# EAGLE design femtoBeacon_dongle_r2.0.1 (EAGLE 7.5.0)
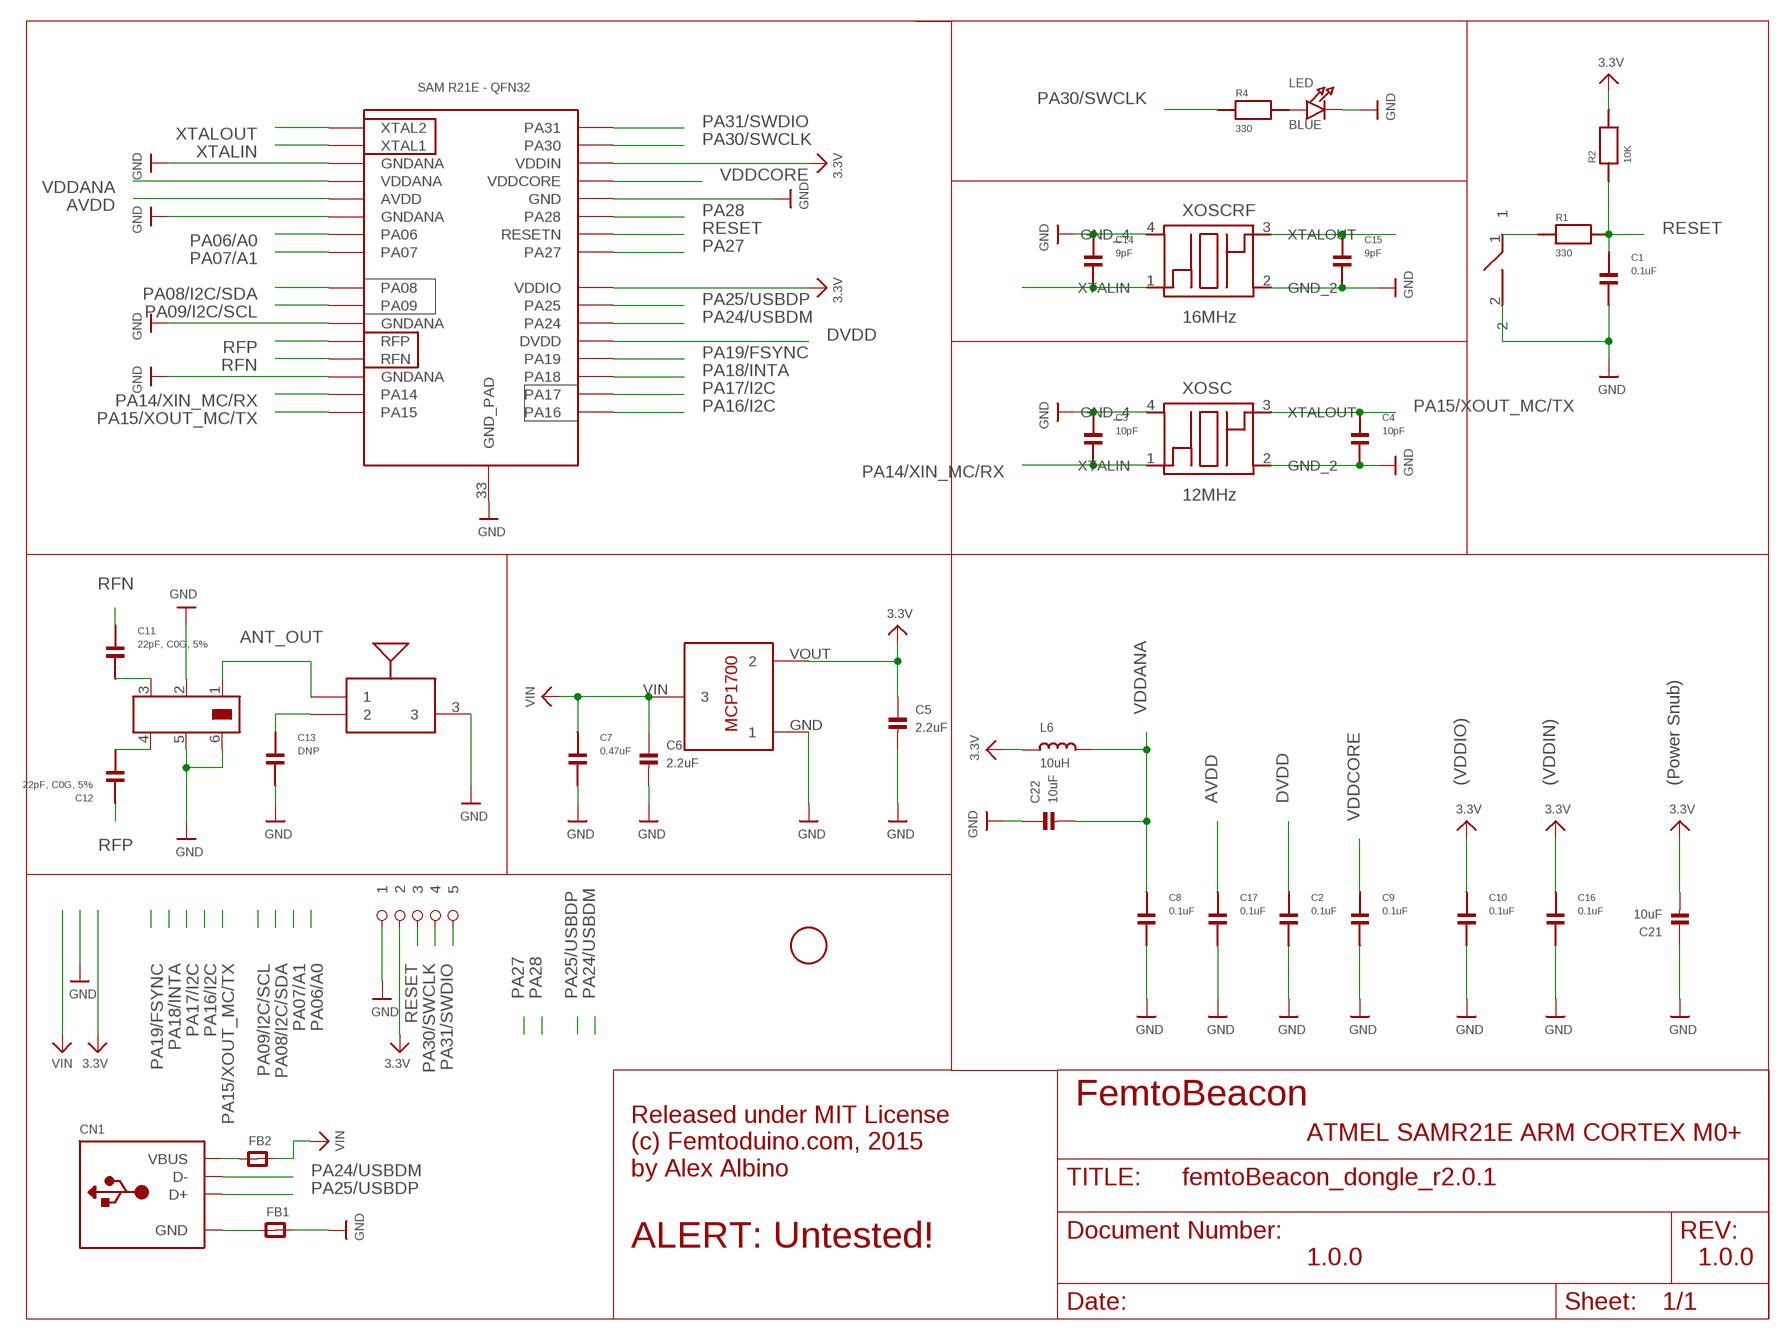
[diagram p0: schematic, sheet 1]

## Parts
ANT1  PULSE_ANT_2.4GHZ  [ANT_BAR]
BTN  DNP  SPST_SMD  [SPST_SMD]
C1  0.1uF  CAPACITOR_0201  [PART]
C2  0.1uF  CAPACITOR_0201  [PART]
C3  10pF  CAPACITOR_0201  [PART]
C4  10pF  CAPACITOR_0201  [PART]
C5  2.2uF  CAP_CERAMIC_0402MP  [_0402MP]
C6  2.2uF  CAP_CERAMIC_0402MP  [_0402MP]
C7  0.47uF  CAPACITOR_0201  [PART]
C8  0.1uF  CAPACITOR_0201  [PART]
C9  0.1uF  CAPACITOR_0201  [PART]
C10  0.1uF  CAPACITOR_0201  [PART]
C11  22pF, C0G, 5%  CAPACITOR_0201  [PART]
C12  22pF, C0G, 5%  CAPACITOR_0201  [PART]
C13  DNP  CAPACITOR_0201  [PART]
C14  9pF  CAPACITOR_0201  [PART]
C15  9pF  CAPACITOR_0201  [PART]
C16  0.1uF  CAPACITOR_0201  [PART]
C17  0.1uF  CAPACITOR_0201  [PART]
C21  10uF  CAP_CERAMIC_0402MP  [_0402MP]
C22  10uF  CAP_CERAMIC_0402MP  [_0402MP]
CN1  USB_TYPEA  [USB_A-SMT]
FB1  FERRITE_0603MP  [_0603MP]
FB2  FERRITE_0603MP  [_0603MP]
FIDUCIAL  FIDUCIAL  [FIDUCIAL_1MM]
L6  10uH  INDUCTOR_0603MP  [_0603MP]
LDO_VREG  MCP1700T-3302E/TT  [MCP1700T-3302E/TT]
LED  BLUE  LED0603_NOOUTLINE  [CHIPLED_0603_NOOUTLINE]
R1  330  RESISTOR_0201  [PART]
R2  10K  RESISTOR_0201  [PART]
R4  330  RESISTOR_0201  [PART]
U$1  1X5_ROUND  [1X5_ROUND]
U$12  JOHANSON_2450BM15A0015E  [0805_BALUN]
U$76  ATSAMR21E18A-MUT  [QFN32]
XOSC  12MHz  TSX-3225  [TSX-3225]
XOSCRF  16MHz  TSX-3225  [TSX-3225]

## Nets
3.3V: C5.1 C10.1 C16.1 C21.2 L6.1 LDO_VREG.VOUT R2.2 U$1.P$2 U$76.24(VDDIO) U$76.30(VDDIN)
ANT_OUT: ANT1.1 U$12.1
AVDD: C17.1 U$76.5(AVDD)
DVDD: C2.1 U$76.21(DVDD)
GND: ANT1.3 BTN.2 C1.2 C2.2 C3.1 C4.2 C5.2 C6.2 C7.2 C8.2 C9.2 C10.2 C13.2 C14.1 C15.2 C16.2 C17.2 C21.1 C22.1 FB1.2 LDO_VREG.GND LED.C U$1.P$1 U$12.2 U$12.5 U$12.6 U$76.3(GNDANA) U$76.6(GNDANA) U$76.11(GNDANA) U$76.14(GNDANA) U$76.28(GND) U$76.33(GND_PAD) XOSC.2(GND_2) XOSC.4(GND_4) XOSCRF.2(GND_2) XOSCRF.4(GND_4)
N$1: C11.2 U$12.3
N$2: ANT1.2 C13.1
N$3: C12.2 U$12.4
N$4: CN1.VBUS FB2.1
N$5: CN1.GND FB1.1
N$13: LED.A R4.2
N$26: BTN.1 R1.1
PA06/A0: U$76.7(PA06)
PA07/A1: U$76.8(PA07)
PA08/I2C/SDA: U$76.9(PA08)
PA09/I2C/SCL: U$76.10(PA09)
PA14/XIN_MC/RX: C3.2 U$76.15(PA14) XOSC.1(XTALIN)
PA15/XOUT_MC/TX: C4.1 U$76.16(PA15) XOSC.3(XTALOUT)
PA16/I2C: U$76.17(PA16)
PA17/I2C: U$76.18(PA17)
PA18/INTA: U$76.19(PA18)
PA19/FSYNC: U$76.20(PA19)
PA24/USBDM: CN1.D- U$76.22(PA24)
PA25/USBDP: CN1.D+ U$76.23(PA25)
PA27: U$76.25(PA27)
PA28: U$76.27(PA28)
PA30/SWCLK: R4.1 U$1.P$4 U$76.31(PA30)
PA31/SWDIO: U$1.P$5 U$76.32(PA31)
RESET: C1.1 R1.2 R2.1 U$1.P$3 U$76.26(RESETN)
RFN: C11.1 U$76.13(RFN)
RFP: C12.1 U$76.12(RFP)
VDDANA: C8.1 C22.2 L6.2 U$76.4(VDDANA)
VDDCORE: C9.1 U$76.29(VDDCORE)
VIN: C6.1 C7.1 FB2.2 LDO_VREG.VIN
XTALIN: C14.2 U$76.2(XTAL1) XOSCRF.1(XTALIN)
XTALOUT: C15.1 U$76.1(XTAL2) XOSCRF.3(XTALOUT)

## Notes on the sheet
- (VDDIO) | (VDDIN) | (Power Snub)
- FemtoBeacon
- ATMEL SAMR21E ARM CORTEX M0+
- Released under MIT License
  (c) Femtoduino.com, 2015
  by Alex Albino
- ALERT: Untested!
- 1.0.0 | 1.0.0

## Library data of the parts
ANT1 = bar_antenna:PULSE_ANT_2.4GHZ: Manufacturer part #W3008
BTN = femtoduino:SPST_SMD
C1 C3 C4 C8-C17 = parts_0201:CAPACITOR_0201; DIGIKEY_PART: 490-3194-1-ND
C2 C7 = parts_0201:CAPACITOR_0201
C5 C6 C21 C22 = microbuilder:CAP_CERAMIC: Ceramic Capacitors 0402 - 0402 Surface Mount Capacitors 16pF 50V 5% [Digikey: 445-4899-2-ND] 18pF 50V 5% [Digikey: 490-1281-2-ND] 22pF 50V 5% [Digikey: 490-1283-2-ND] 68pF 50V 5% [Digikey: 490-1289-2-ND] 0.1uF 10V 10% [Digikey: 490-1318-2-ND] 1.0uF 6.3V 10% [Digikey: 490-1320-2-ND] 0603 - 0603 Surface Mount Capacitors 16 pF 50V 5% [Digikey: 445-5051-2-ND] 22 pF 50V [Digikey: PCC220ACVTR-ND] 33 pF 50V 5% [Digikey: 490-1415-1-ND] 56pF 50V 5% [Digikey: 490-1421-1-ND] 220pF 50V 5% [Digikey: 445-1285-1-ND] 680 pF 50V 2200 pF 50V 5% C0G [Digikey: 445-1297-1-ND] 5600 pF 100V 5% X7R [Digikey: 478-3711-1-ND] 0.1 µF 25V 10% [Digikey: PCC2277TR-ND] 0.22 µF 16V 10% X7R [Digikey: 445-1318-1-ND] 1.0 µF 25V 10% [Digikey: 445-5146-2-ND] 0603 - RF Specific 3pF 250V +/-0.1pF RF [Digikey: 712-1347-1-ND] 18 pF 250V 5% [Digikey: 478-3505-1-ND or 712-1322-1-ND] 56 pF 250V 5% C0G RF [Digikey: 490-4867-1-ND] 68 pF 250V RF [Digikey: 490-4868-1-ND] 0805 - 0805 Surface Mount Capacitors 220 pF 250V 2% RF Ceramic Capacitor [Digikey: 712-1398-1-ND] 1000 pF 50V 2% NP0 Ceramic Capacitor [Digikey: 478-3760-1-ND] 0.1 µF 25V 10% Ceramic Capacitor [Digikey: PCC1828TR-ND] 1.0 µF 16V 10% Ceramic Capacitor[Digikey: 490-1691-2-ND] 10.0 µF 10V 10% Ceramic Capacitor[Digikey: 709-1228-1-ND] 10.0 uF 16V 10% Ceramic Capacitor [Digikey: 478-5165-2-ND] 47 uF 6.3V 20% Ceramic Capacitor [Digikey: 587-1779-1-ND or 399-5506-1-ND] 1206 - 1206 Surface Mount Capacitors 47uF 10V 20% Ceramic Capacitor [Digikey: 490-5528-1-ND or 399-5508-1-ND or 445-6010-1-ND] 100uF 6.3V -20%, +80% Y5V Ceramic Capacitor (Digikey: 490-4512-1-ND, Mouser: 81-GRM31CF50J107ZE1L)
CN1 = microbuilder:USB_TYPEA: USB - Type A Connectors Male types stick out and are inserted into a PC or matching females parts (these are the connectors used on USB Memory Sticks, etc.). Female parts are generally used for USB Host and accept a male-type connector. SMT Male - 4UCON: 10017 PTH Female - Digikey: 609-1045-ND, 4UCon: 05241
FB1 FB2 = microbuilder:FERRITE: Ferrite Bead 0603 MMZ1608B121C - 120 Ohm @ 100MHz, 600mA, 0.15 Ohm DC Resistance - Digikey: 445-2164-1-ND BK1608HW121-T - 120 Ohm, 600mA Ferrite Chip - Digikey: 587-1876-2-ND 0805 HZ0805B272R-10 - 2.7K Ohm @ 100MHz, 200mA, 0.8 Ohm DC Resistance - Digikey: 240-2504-1-ND (see also Murata BLM21BD272SN1L) MMZ2012Y152B - 1.5K Ohm @ 100MHz, 500mA, 0.4 Ohm DC Resistance - Digikey: 445-1560-1-ND - Mainly for high frequency (80-400MHz) MMZ2012R102A - 1K Ohm @ 100MHz, 500mA, 0.3 Ohm DC Resistance - Digikey: 445-1555-2-ND - More general purpose (10-200MHz)
FIDUCIAL = adafruit:FIDUCIAL: For use by pick and place machines to calibrate the vision/machine, 1mm By microbuilder.eu
L6 = microbuilder:INDUCTOR: Inductors 0603: 10nH Ceramic Inductor - microwire antenna/RF (Digikey: 712-1434-2-ND) 0805: 560nH Ceramic Inductor - RF (Digikey: 553-1047-1-ND) 270nH Ceramic Inductor - Q = 40@250MHz, +-5%, 1 Ohm DC Resistance (Digikey: 535-10506-2-ND) 1007 (2518 Metric) SMT: 10µH 10% 250mOhm 820mA 1007 Inductor (Digikey: 587-2189-1-ND) 22µH 10% 500mOhm 580mA 1007 Inductor (Digikey: 587-2190-1-ND) 47µH 10% 950mOhm 420mA 1007 Inductor (Digikey: 587-2191-1-ND) 47µH 5% 100mOhm 1A 1008 Inductor (Digikey: 732-1816-1-ND) 5.0x5.0mm (Taiyo Yuden NR5040 Series) 6.8µH 20% 2.3A 64mOhm Inductor (Digikey: 587-2374-2-ND) 5.0x5.0mm (TDK VLC5045 Series) 4.7µH 20% 3.3A 34mOhm Inductor (Digikey: 445-6526-1-ND) 6.8µH 20% 2.7A 46mOhm Inductor (Digikey: 445-6527-1-ND) 6.0x6.0mm (TDK VLC6045 Series) 4.7µH 20% 3.8A 27mOhm Inductor (Digikey: 445-6538-2-ND) 6.8µH 20% 3A 41mOhm Inductor (Digikey: 445-6540-1-ND) 6.2µH 30% 2.2A 45mOhm Inductor (Digikey: SRR5028-6R2YCT-ND) - Not TDK VLC6045 but footprint should match 6.0x6.0mm (TDK SLF6045 Series) 6.8uH 30% 2A 33mOhm Inductor (Digikey: 445-4572-1-ND, Mouser: 810-SLF645T6R8N2R0PF)
LDO_VREG = MCP1700T-3302E_TT:MCP1700T-3302E/TT: Microchip LDO "MCP1700" in a 3-Pin SOT-23 package. ID: MCP1700T-3302E/TT
LED = microbuilder:LED: LED 0603 - 0603 Surface Mount Package 2mA: Green LED - Low Power (3.9mcd, 2ma, 1.7Vf) - Digikey: 475-2709-2-ND Orange LED - Low Power (9.8mcd, 2ma, 1.8Vf) - Digikey: 475-1194-2-ND Red LED - Low Power (5mcd, 2ma, 1.8Vf) - Digikey: 475-1195-2-ND Yellow LED - Low Power (7mcd, 2ma, 1.8Vf) - Digikey: 475-1196-2-ND 5mA: Blue LED - Low Power (17mcd, 5ma, 2.9Vf) - Digikey: LNJ937W8CRACT-ND 0805 - 0805 Surface Mount Package 2mA: Red LED (8.8mcd, 2mA, 1.8Vf, Clear) - Low Power [Digikey: 475-2510-1-ND] Green LED (5mcd, 2mA, 1.8Vf, Clear) - Low Power [Digikey: 475-2730-1-ND] Yellow LED (11.3mcd, 2mA, 1.8Vf, Clear) - Low Power [Digikey: 475-2555-1-ND] 20mA: Red LED (104mcd, 20mA, Diffused) - LS R976 [Digikey: 475-1278-6-ND] Red LED (12mcd, 20mA, 2.0Vf, Clear) - APT2012EC [Digikey: 754-1128-1-ND] Green LED (15mcd, 20mA, 2.2Vf, Clear) - APT2012GC [Digikey: 754-1131-1-ND] Orange LED (160mcd, 20mA, 2.1Vf, Clear) - APT2012SECK [Digikey: 754-1130-1-ND] 1206 - 1206 Surface Mount Package Green LED (26mcd, 20mA, Diffused) - LG N971 [Digikey: 475-1407-6-ND] Red LED (15mcd, 20mA, Diffused) - LH N974 [Digikey: 475-1416-6-ND]
R1 R2 R4 = parts_0201:RESISTOR_0201
U$1 = pins_fine_pitch:1X5_ROUND
U$12 = balun:JOHANSON_2450BM15A0015E
U$76 = atmel-samr21:ATSAMR21E18A-MUT: This is the ATMEL SAMR21E QFN-32. ATSAMR21E18A
XOSC XOSCRF = crystals:TSX-3225

## Board
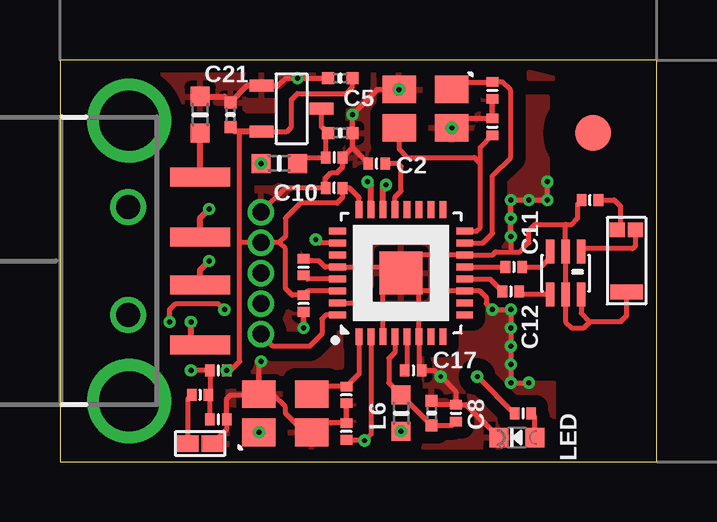
[diagram p1: board, top side]
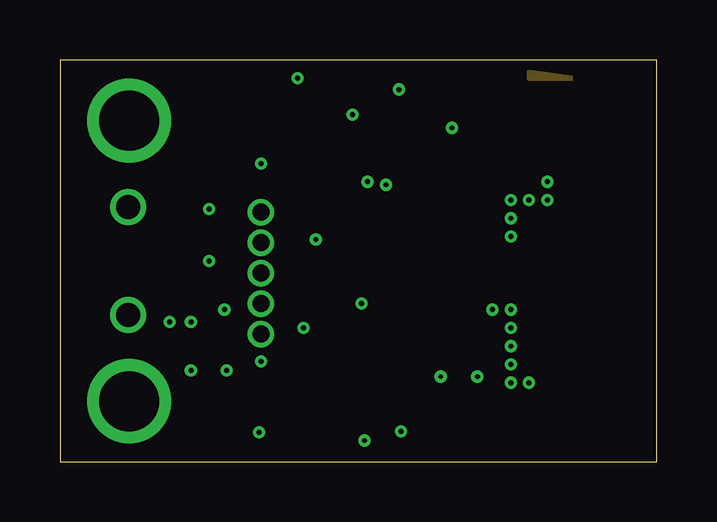
[diagram p2: board, inner layer Route2]
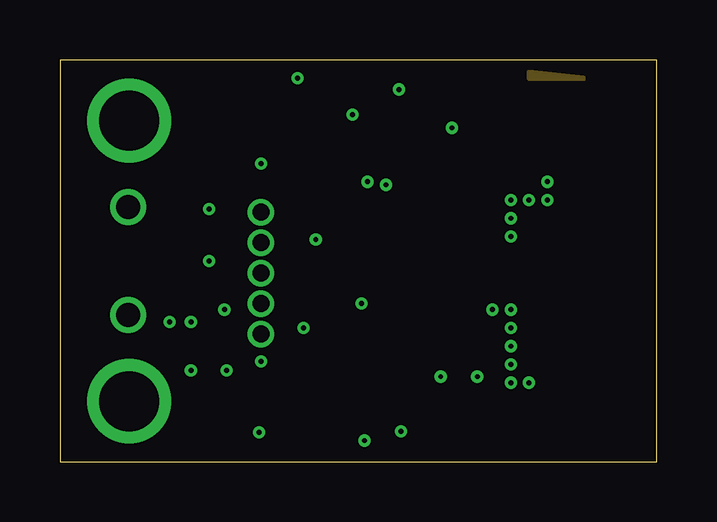
[diagram p3: board, inner layer Route15]
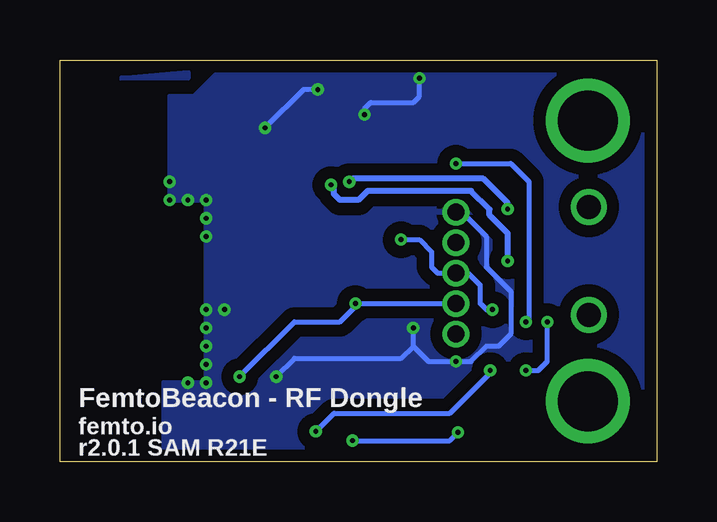
[diagram p4: board, bottom side, seen from below]

Size 24.89 x 16.76 mm. Coordinates in mm from the lower left corner, seen from the top.
Outline: 0,0 24.89,0 24.89,16.76 0,16.76 0,0
Copper layers (1+2*15+16): Top 0.035mm / dielectric 1.5mm / Route2 0.035mm / dielectric 0.15mm / Route15 0.035mm / dielectric 0.2mm / Bottom 0.035mm
Design rules "femtoduino_5mil_4layer": minimum track width 5mil, minimum drill 5mil, track to track 5mil, track to pad 5mil, pad to pad 5mil, via to via 5mil, smd to smd 5mil, copper to edge 5mil, drill to drill 5mil, minimum pad ring 8mil, minimum via ring 5mil, stop-mask expansion 2mil, vias tented up to drill 30mil, thermal gap 10mil

### Footprints (pad centres in the part's own frame; a part is rotated, then mirrored left to right if it is on the bottom)
ANT_BAR = smd 0.62 x 0.61: 1 -1.3,0.37; 2 -1.3,-0.38 | smd 0.62 x 1.36: 3 1.3,0
SPST_SMD = smd 0.889 x 0.699: 1 -0.508,0; 2 0.508,0
PART = smd 0.4 x 0.5: 1 -0.35,0; 2 0.35,0
_0402MP = smd 0.5 x 0.5: 1 -0.508,0; 2 0.508,0
USB_A-SMT = drill 2.5 pad 3.302: D1 -5.85,2.958; D2 5.85,2.958 | drill 1: D3 -2.25,3; D4 2.25,3 | smd 0.8 x 2.5: D+ 1,0; D- -1,0; GND 3.5,0; VBUS -3.5,0
_0603MP = smd 0.8 x 0.8: 1 -0.762,0; 2 0.762,0
FIDUCIAL_1MM = smd 1.5 x 1.5: 1 0,0
MCP1700T-3302E/TT = smd 0.5 x 1: GND -0.95,-1.25; VIN 0,1.25; VOUT 0.95,-1.25
CHIPLED_0603_NOOUTLINE = smd 0.8 x 0.8: A 0,-0.75; C 0,0.75
1X5_ROUND = drill 0.7 pad 1: P$1 0,0; P$2 0,-1.27; P$3 0,-2.54; P$4 0,-3.81; P$5 0,-5.08
0805_BALUN = smd 1 x 0.35: 1 -0.9,0.65; 2 -0.9,0; 3 -0.9,-0.65; 4 0.9,-0.65; 5 0.9,0; 6 0.9,0.65
QFN32 = smd 0.7 x 0.3: 1 -2.65,1.75; 2 -2.65,1.25; 3 -2.65,0.75; 4 -2.65,0.25; 5 -2.65,-0.25; 6 -2.65,-0.75; 7 -2.65,-1.25; 8 -2.65,-1.75; 17 2.65,-1.75; 18 2.65,-1.25; 19 2.65,-0.75; 20 2.65,-0.25; 21 2.65,0.25; 22 2.65,0.75; 23 2.65,1.25; 24 2.65,1.75 | smd 0.3 x 0.7: 9 -1.75,-2.65; 10 -1.25,-2.65; 11 -0.75,-2.65; 12 -0.25,-2.65; 13 0.25,-2.65; 14 0.75,-2.65; 15 1.25,-2.65; 16 1.75,-2.65; 25 1.75,2.65; 26 1.25,2.65; 27 0.75,2.65; 28 0.25,2.65; 29 -0.25,2.65; 30 -0.75,2.65; 31 -1.25,2.65; 32 -1.75,2.65 | smd 1.8 x 1.8: 33 0,0
TSX-3225 = smd 1.4 x 1.15: 1 -1.1,-0.8; 2 1.1,-0.8; 3 1.1,0.8; 4 -1.1,0.8

### Placement (x,y rotation side)
ANT1  23.62,8.38 270 top
BTN  5.84,0.76 0 top
C1  6.6,1.78 0 top
C2  13.21,12.45 180 top
C3  18.03,15.49 90 top
C4  18.03,13.97 90 top
C5  11.68,16 180 top
C6  11.68,13.72 0 top
C7  11.43,12.7 0 top
C8  16.51,2.03 90 top
C9  10.16,8.13 90 top
C10  11.43,11.43 180 top
C11  18.92,8.13 0 top
C12  18.8,7.11 0 top
C13  22.1,10.92 180 top
C14  11.94,1.27 270 top
C15  11.94,2.79 270 top
C16  10.16,6.6 270 top
C17  14.73,3.81 0 top
C21  7.11,14.48 270 top
C22  15.49,2.03 270 top
CN1  5.84,8.38 90 top
FB1  5.84,14.48 90 top
FB2  9.14,12.45 0 top
FIDUCIAL  22.23,13.72 0 top
L6  14.22,2.03 90 top
LDO_VREG  9.65,14.73 270 top
LED  19.05,1.02 90 top
R1  5.84,2.79 0 top
R2  6.6,3.81 0 top
R4  19.3,2.03 0 top
U$1  8.38,10.41 0 top
U$12  21.08,7.87 270 top
U$76  14.22,7.87 90 top
XOSC  15.24,14.73 180 top
XOSCRF  9.4,2.03 0 top

### Tracks (layer width: path | path; a pad name or v marks a point on that pad's centre or on a via)
3.3V  (via drill 0.2 pad 0.51)
  Top 0.203: LDO_VREG.VOUT 9.46,13.78 9.65,13.97 9.65,15.11 9.91,15.37 11.94,15.37 12.19,15.62 C5.1 | U$76.24 12.47,11.02 12.06,11.43 C10.1 11.78,11.02 11.56,10.79 10.03,10.79 9.4,10.16 9.4,9.4 9.14,9.14 | 7.49,9.14 7.49,13.78 | 9.14,9.14 U$1.P$2 | U$76.30 10.33,7.12 C16.1 9.68,6.95 9.4,7.24 9.4,8.89 9.14,9.14 | R2.2 7.11,3.81 7.49,4.19 7.49,9.14 | 8.26,9.14 U$1.P$2 | U$1.P$2 7.49,9.14
  Top 0.254: LDO_VREG.VOUT 7.49,13.78 7.3,13.78 C21.2
  Bottom 0.203: L6.1 13.46,2.03 8.64,2.03 6.95,3.71 R2.2
  other vias: 14.22,1.27 6.95,3.81
ANT_OUT
  Top 0.203: ANT1.1 23.99,9.01 23.88,8.89 21.85,8.89 U$12.1
AVDD
  Top 0.203: U$76.5 14.47,3.9 C17.1
DVDD
  Top 0.203: U$76.21 13.97,11.05 14.22,11.3 14.22,12.32 14.1,12.45 C2.1
GND  (via drill 0.2 pad 0.51)
  Top 0.203: LDO_VREG.GND 9.08,15.68 9.4,16 v9.91,16 C5.2 | XOSC.2 13.25,15.53 v12.19,14.48 C6.2 12.19,13.11 | XOSC.4 16.73,14.32 C4.2 C3.1 | U$76.33 14.97,8.62 U$76.14 18.02,8.62 18.16,8.76 18.8,8.76 | 18.8,8.76 19.18,8.76 19.56,9.14 19.56,9.65 19.81,9.91 21.08,9.91 | 21.08,9.91 21.34,9.91 21.59,10.16 21.59,10.76 C13.2 | 21.08,9.91 U$12.2 U$12.5 21.08,5.84 21.34,5.59 21.84,5.59 22.1,5.84 | ANT1.3 23.62,6.1 23.37,5.84 22.1,5.84 | 22.1,5.84 21.73,6.21 U$12.6 | BTN.2 6.95,1.37 C1.2 6.95,2.64 7.11,2.79 8.26,2.79 XOSCRF.4 | XOSCRF.4 8.85,2.83 9.4,2.29 9.4,2.03 10.2,1.23 XOSCRF.2 10.89,1.62 C14.1 C15.2 | 14.97,7.12 U$76.6 14.97,3.92 C17.2 15.62,3.81 v15.88,3.56 16.51,2.92 C8.2 | U$76.33 13.97,8.12 U$76.28 11.05,8.12 10.79,8.38 10.26,8.38 C9.2 | 12.19,13.11 C7.2 11.78,12.29 11.56,12.06 11.3,12.06 11.08,11.84 C10.2 9.4,11.43 U$1.P$1 | C16.2 v10.16,5.59 | XOSCRF.4 8.3,4.11 v8.38,4.19 | U$76.3 13.47,7.12 U$76.33 | C8.2 15.65,2.38 C22.1 | C8.2 16.93,2.38 LED.C | C2.2 12.19,13.11 | v20.32,11.68 v20.32,10.92 v19.56,10.92 v18.8,10.92 v18.8,10.16 v18.8,9.4 18.8,8.76 | v19.56,3.3 v18.8,3.3 v18.8,4.06 v18.8,4.83 v18.8,5.59 v18.8,6.35 v18.03,6.35 17.78,6.6 17.78,6.86 17.51,7.12 U$76.11 14.97,7.12 | 14.97,7.12 U$76.33
  Top 0.254: FB1.2 6.86,15.24 C21.1 7.81,15.68 LDO_VREG.GND
  Bottom 0.203: v12.19,14.48 12.19,14.73 11.94,14.99 10.16,14.99 9.91,15.24 v9.91,16 | XOSC.2 14.74,15.53 XOSC.4 | v15.88,3.56 15.11,4.32 10.67,4.32 10.16,4.83 | 10.16,4.83 v10.16,5.59 | 10.16,4.83 9.53,4.19 v8.38,4.19 7.75,4.19 7.11,4.83 6.6,4.83 6.1,5.33 6.1,7.11 7.11,8.13 7.11,9.4 8.13,10.41 U$1.P$1
  other vias: 14.14,15.53 16.34,13.93
  pour Bottom (isolate 0.508): 0.25,16.51 18.03,16.51 19.3,15.24 20.32,15.24 20.32,10.92 18.8,10.92 18.8,3.3 20.57,3.3 20.57,0.25 0.25,0.25
  pour Top (isolate 0.508): 0.25,16.51 18.03,16.51 19.3,15.24 20.32,15.24 20.32,10.92 18.8,10.92 18.8,3.3 20.57,3.3 20.57,0.25 0.25,0.25
N$1
  Top 0.203: C11.2 20.07,8.13 20.43,8.49 U$12.3
N$2
  Top 0.203: C13.1 23.11,10.92 23.37,10.67 23.37,9.81 ANT1.2
N$3
  Top 0.203: U$12.4 19.28,6.97 C12.2
N$4  (via drill 0.2 pad 0.51)
  Top 0.254: CN1.VBUS 5.46,4.88 v5.46,5.84
  Bottom 0.203: FB2.1 6.1,12.45 5.33,11.68 5.33,5.97 v5.46,5.84
  other vias: 8.38,12.45
N$5
  Top 0.254: CN1.GND FB1.1
N$6
  pour Top: 19.56,16.26 19.56,16 20.57,16
N$7
  pour Route2: 19.56,16.26 19.56,16 21.34,16
N$8
  pour Route15: 19.56,16.26 19.56,16 21.84,16
N$9
  pour Bottom: 19.56,16.26 19.56,16 22.35,16
N$13
  Top 0.203: LED.A 19.8,1.89 R4.2
N$26
  Top 0.203: BTN.1 5.33,2.64 R1.1
PA14/XIN_MC/RX
  Top 0.203: U$76.15 17.63,9.12 18.03,9.53 18.03,11.94 18.8,12.7 18.8,15.49 18.45,15.84 C3.2 16.65,15.84 XOSC.1
PA15/XOUT_MC/TX
  Top 0.203: U$76.16 17.37,9.62 17.53,9.78 17.53,12.45 | 17.53,12.45 17.53,13.11 C4.1 | XOSC.3 14.14,13.04 14.48,12.7 17.27,12.7 17.53,12.45
PA24/USBDM  (via drill 0.2 pad 0.51)
  Top 0.254: U$76.22 13.47,11.44 v13.59,11.56 | CN1.D- 5.84,8 v6.22,8.38
  Bottom 0.254: v6.22,8.38 6.22,9.53 6.99,10.29 6.99,10.54 7.75,11.3 12.06,11.3 12.45,10.92 13.22,10.92 13.47,11.18 13.47,11.44 v13.59,11.56
PA25/USBDP  (via drill 0.2 pad 0.51)
  Top 0.254: CN1.D+ 5.84,10.16 v6.22,10.54 | U$76.23 12.97,11.54 v12.83,11.68
  Bottom 0.254: v6.22,10.54 6.22,10.79 7.24,11.81 12.7,11.81 v12.83,11.68
PA30/SWCLK  (via drill 0.2 pad 0.51)
  Top 0.203: U$76.31 12.55,6.62 v12.57,6.6 | v17.4,3.56 18.92,2.03 R4.1
  Bottom 0.203: U$1.P$4 v12.57,6.6 12.57,6.48 13.21,5.84 15.11,5.84 v17.4,3.56
PA31/SWDIO
  Top 0.203: U$76.32 11.08,6.12 10.92,5.97 10.92,5.33 10.41,4.83 8.89,4.83 U$1.P$5
RESET  (via drill 0.2 pad 0.51)
  Top 0.203: C1.1 6.25,2.73 R1.2 6.25,2.86 R2.1 v5.46,3.81 | U$76.26 10.81,9.12 v10.67,9.27 | v4.57,5.84 4.57,6.35 4.83,6.6 6.6,6.6 v6.86,6.35
  Bottom 0.203: v10.67,9.27 9.91,9.27 9.4,8.76 9.4,8.13 9.14,7.87 U$1.P$3 7.87,7.87 7.37,7.37 7.37,6.6 7.11,6.35 v6.86,6.35 | v4.57,5.84 4.57,4.19 4.95,3.81 v5.46,3.81
RFN
  Top 0.203: U$76.13 18.44,8.12 C11.1
RFP
  Top 0.203: U$76.12 17.93,7.62 C12.1
VDDANA
  Top 0.203: U$76.4 13.97,4.58 13.72,4.32 13.72,3.3 L6.2 C22.2 16.35,1.52 C8.1
VDDCORE
  Top 0.203: U$76.29 10.31,7.62 C9.1
VIN
  Top 0.203: FB2.2 10.16,12.7 C7.1 11.08,13.62 C6.1 10.9,13.99 LDO_VREG.VIN
XTALIN  (via drill 0.2 pad 0.51)
  Top 0.203: C14.2 12.67,0.92 v12.7,0.89 12.97,1.16 U$76.2
  Bottom 0.203: v12.7,0.89 8.64,0.89 XOSCRF.1
  other vias: 8.3,1.23
XTALOUT
  Top 0.203: XOSCRF.3 10.81,3.14 C15.1 12.47,3.68 U$76.1

### Text on the board
bNames: FemtoBeacon - RF Dongle | femto.io | r2.0.1 SAM R21E